# Altium schematic sheet 功率开关.SchDoc
size A4
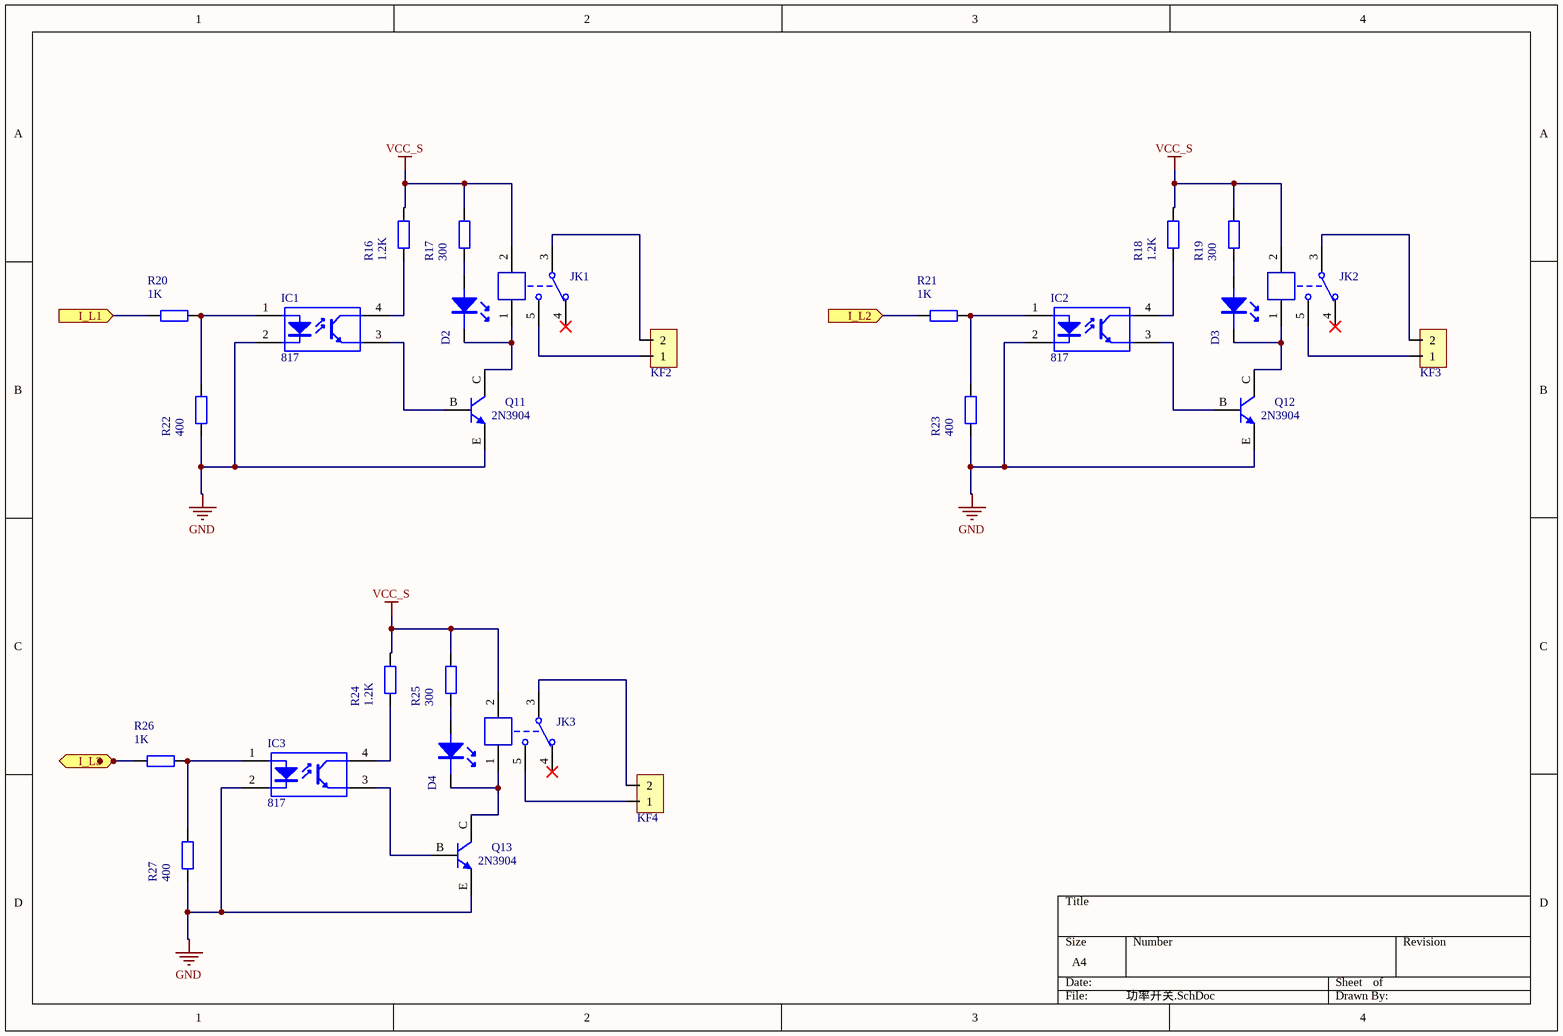
[diagram p0: 功率开关.SchDoc]

## Parts
D2  C535A WJN CU0V0231  [LED2-D5X5]  (value not drawn)
D3  C535A WJN CU0V0231  [LED2-D5X5]  (value not drawn)
D4  C535A WJN CU0V0231  [LED2-D5X5]  (value not drawn)
IC1  817  [DIP4-300]
IC2  817  [DIP4-300]
IC3  817  [DIP4-300]
JK1  SRD-05VDC-SL-C  [SRD-C_B]  (value not drawn)
JK2  SRD-05VDC-SL-C  [SRD-C_B]  (value not drawn)
JK3  SRD-05VDC-SL-C  [SRD-C_B]  (value not drawn)
KF2  KF301-5.08-2p  [KF301-5.0-2P]  (value not drawn)
KF3  KF301-5.08-2p  [KF301-5.0-2P]  (value not drawn)
KF4  KF301-5.08-2p  [KF301-5.0-2P]  (value not drawn)
Q11  2N3904  [TO-92-3-EBC]
Q12  2N3904  [TO-92-3-EBC]
Q13  2N3904  [TO-92-3-EBC]
R16  1.2K  [RY0R25W]
R17  300  [RY0R25W]
R18  1.2K  [RY0R25W]
R19  300  [RY0R25W]
R20  1K  [RY0R25W]
R21  1K  [RY0R25W]
R22  400  [RY0R25W]
R23  400  [RY0R25W]
R24  1.2K  [RY0R25W]
R25  300  [RY0R25W]
R26  1K  [RY0R25W]
R27  400  [RY0R25W]

## Ports
I_L1 (in), I_L2 (in), I_L3 (in)

## Nets
GND: IC1.2(K) IC2.2(K) IC3.2(K) Q11.E Q12.E Q13.E R22.1 R23.1 R27.1
VCC_S: JK1.2 JK2.2 JK3.2 R16.2 R17.2 R18.2 R19.2 R24.2 R25.2
I_L1: R20.1 ; port I_L1
I_L2: R21.1 ; port I_L2
I_L3: R26.1 ; port I_L3
NetD2_1: D2.1 R17.1
NetD2_2: D2.2 JK1.1 Q11.C
NetD3_1: D3.1 R19.1
NetD3_2: D3.2 JK2.1 Q12.C
NetD4_1: D4.1 R25.1
NetD4_2: D4.2 JK3.1 Q13.C
NetIC1_1: IC1.1(A) R20.2 R22.2
NetIC1_3: IC1.3(E) Q11.B
NetIC1_4: IC1.4(C) R16.1
NetIC2_1: IC2.1(A) R21.2 R23.2
NetIC2_3: IC2.3(E) Q12.B
NetIC2_4: IC2.4(C) R18.1
NetIC3_1: IC3.1(A) R26.2 R27.2
NetIC3_3: IC3.3(E) Q13.B
NetIC3_4: IC3.4(C) R24.1
NetJK1_3: JK1.3 KF2.2
NetJK1_5: JK1.5 KF2.1
NetJK2_3: JK2.3 KF3.2
NetJK2_5: JK2.5 KF3.1
NetJK3_3: JK3.3 KF4.2
NetJK3_5: JK3.5 KF4.1

Not connected (* = marked no-connect by the designer): JK1 4*; JK2 4*; JK3 4*

## Library data of the parts
D2-D4 = 102DL-00002DG.01: DIP,封装/间距直径5/2.54mm,额定电压3.2V,亮度高亮,白色; Allow Altenative Part: Y; serial number: 34; Categories: 二极管; Rated Voltage: 3.2V; COMPONENTLINK 1 DESCRIPTION: OpenDatasheet; Remark: Verified by CRD（张宗良） check list V1.0; Modify time: 2017年01月07号; Approved: YES; Part Number: 102DL-00002DG.01; Category: 发光二极管; Value: C535A WJN CU0V0231; Other: 白色; PACKAGE: Bulk; Mounting Type: ThroughHole; Supplier 1: CREE; Supplier Part Number 1: C535A WJN CU0V0231; COMPONENTLINK 1 URL: http://www.cree.com/~/media/Files/Cree/LED-Components-and-Modules/HB/Data-Sheets/C535A-WJN-877.pdf
IC1-IC3 = 817: 线性光耦; 版权归属: 源创客; BOM名称: 线性光耦; 学习资源: www.ooocke.com
JK1-JK3 = SRD-05VDC-SL-C: 5V一组转换; BOM名称: 5V继电器; 版权归属: 源创客; 学习资源: www.ooocke.com
KF2-KF4 = KF301
Q11-Q13 = 102GN-00009BA.01: DIP,封装形式TO-92-3,耐压值40V,额定电流200mA,耗散功率625mW; Allow Altenative Part: Y; serial number: 1; Categories: 三极管; Rated Power: 625mW; Rated Voltage: 40V; Rated Current: 0.2A; COMPONENTLINK 1 DESCRIPTION: OpenDatasheet; Remark: Verified by BU1（吴明徽）check list V1.0; Modify time: 2015年08月08号; Approved: YES; Part Number: 102GN-00009BA.01; Category: NPN三极管; Value: 2N3904; PACKAGE: Tape&Reel; Mounting Type: SurfaceMount; Size: TO-92-3; Supplier 1: ON; Supplier Part Number 1: 2N3904; Pricing 1: .17; COMPONENTLINK 1 URL: http://media.digikey.com/pdf/Data%20Sheets/ON%20Semiconductor%20PDFs/2N3903,%202N3904%20Rev4.pdf; MOQ: 1000
R16-R19 R22-R25 R27 = 102RO-00085BW.01: DIP,阻值1K,精度±0.1%,AXIAL0.4,额定功率1/4W; Allow Altenative Part: Y; serial number: 38; Categories: 电阻; Value: 1K; Tolerance: ±1%; Rated Power: 1/4W; COMPONENTLINK 1 DESCRIPTION: OpenDatasheet; Remark: Verified by BU3（吴明徽）check list V1.0; Modify time: 2015年11月30号; Approved: YES; Part Number: 102RO-00085BW.01; Category: 功率电阻; PACKAGE: Bulk; Mounting Type: ThroughHole; Size: 2.4x6.3mm; Supplier 1: YAGEO; Supplier Part Number 1: MFR-25FTF26-1K; Pricing 1: .08; COMPONENTLINK 1 URL: http://www.yageo.com/NewPortal/_cn/search/search-2.jsp; MOQ: 5000
R20 R21 R26 = 102RO-00085BW.01: DIP,阻值1K,精度±0.1%,AXIAL0.4,额定功率1/4W; Allow Altenative Part: Y; serial number: 38; Categories: 电阻; Tolerance: ±1%; Rated Power: 1/4W; COMPONENTLINK 1 DESCRIPTION: OpenDatasheet; Remark: Verified by BU3（吴明徽）check list V1.0; Modify time: 2015年11月30号; Approved: YES; Part Number: 102RO-00085BW.01; Category: 功率电阻; Value: 1K; PACKAGE: Bulk; Mounting Type: ThroughHole; Size: 2.4x6.3mm; Supplier 1: YAGEO; Supplier Part Number 1: MFR-25FTF26-1K; Pricing 1: .08; COMPONENTLINK 1 URL: http://www.yageo.com/NewPortal/_cn/search/search-2.jsp; MOQ: 5000